# Altium schematic sheet Protoboard.SchDoc
size A
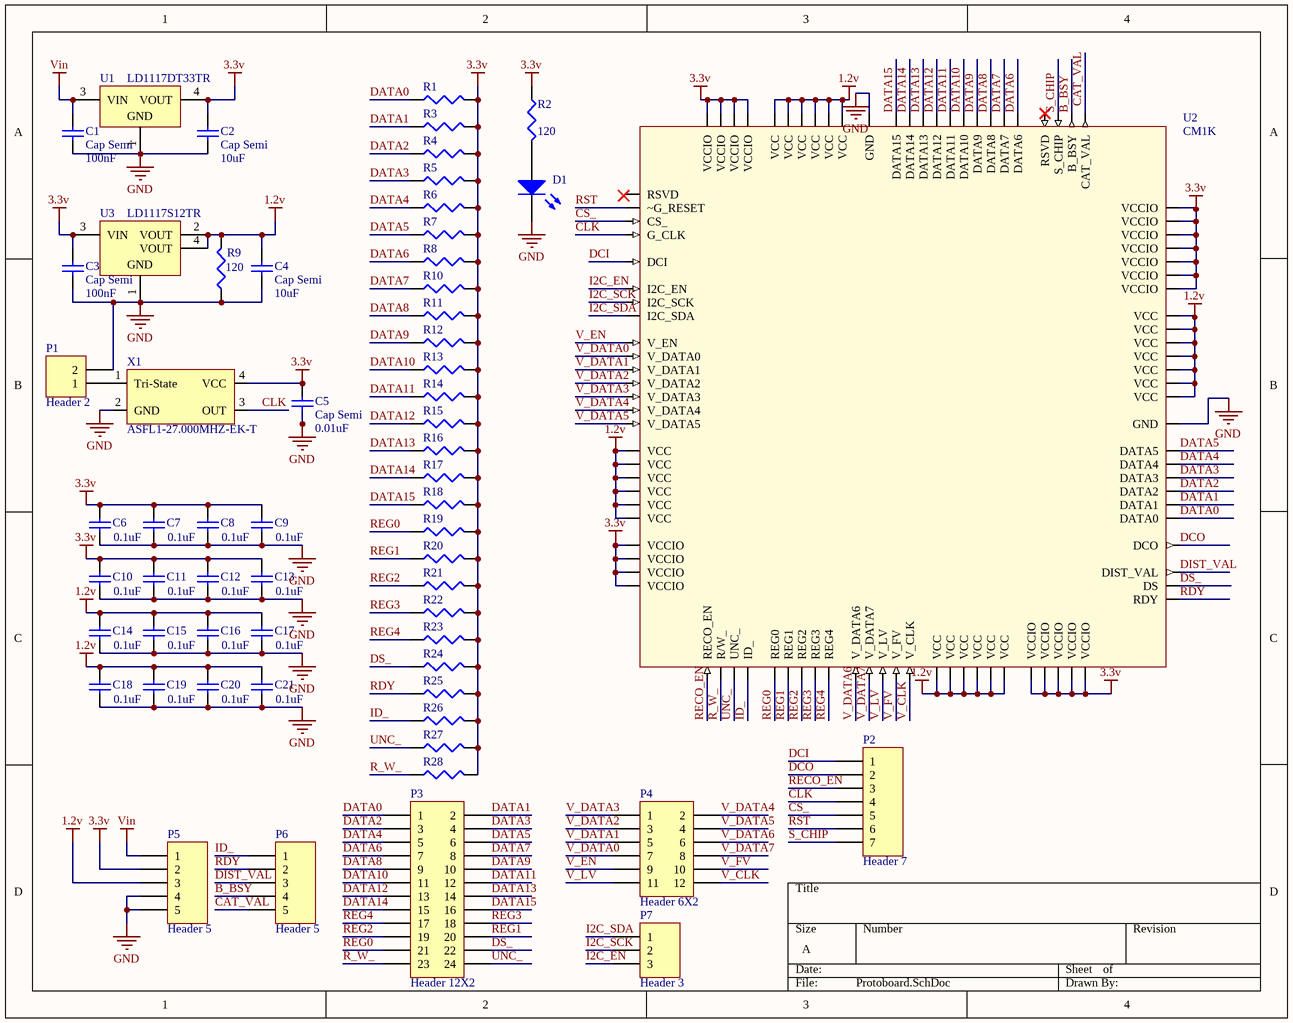
[diagram p0: Protoboard.SchDoc]

## Parts
C1  Cap Semi  value 100nF  [1608[0603]]
C2  Cap Semi  value 10uF  [1608[0603]]
C3  Cap Semi  value 100nF  [1608[0603]]
C4  Cap Semi  value 10uF  [1608[0603]]
C5  Cap Semi  value 0.01uF  [1608[0603]]
C6  value 0.1uF  [1608[0603]]  (hidden comment: Cap Semi)
C7  value 0.1uF  [1608[0603]]  (hidden comment: Cap Semi)
C8  value 0.1uF  [1608[0603]]  (hidden comment: Cap Semi)
C9  value 0.1uF  [1608[0603]]  (hidden comment: Cap Semi)
C10  value 0.1uF  [1608[0603]]  (hidden comment: Cap Semi)
C11  value 0.1uF  [1608[0603]]  (hidden comment: Cap Semi)
C12  value 0.1uF  [1608[0603]]  (hidden comment: Cap Semi)
C13  value 0.1uF  [1608[0603]]  (hidden comment: Cap Semi)
C14  value 0.1uF  [1608[0603]]  (hidden comment: Cap Semi)
C15  value 0.1uF  [1608[0603]]  (hidden comment: Cap Semi)
C16  value 0.1uF  [1608[0603]]  (hidden comment: Cap Semi)
C17  value 0.1uF  [1608[0603]]  (hidden comment: Cap Semi)
C18  value 0.1uF  [1608[0603]]  (hidden comment: Cap Semi)
C19  value 0.1uF  [1608[0603]]  (hidden comment: Cap Semi)
C20  value 0.1uF  [1608[0603]]  (hidden comment: Cap Semi)
C21  value 0.1uF  [1608[0603]]  (hidden comment: Cap Semi)
D1  150060BS75000  [0603_A]  (value not drawn)
P1  Header 2  [HDR1X2]
P2  Header 7  [HDR1X7]
P3  Header 12X2  [HDR2X12]
P4  Header 6X2  [HDR2X6]
P5  Header 5  [HDR1X5]
P6  Header 5  [HDR1X5]
P7  Header 3  [HDR1X3]
R1  Res3  [J1-0603]  (value not drawn)
R2  value 120  [J1-0603]  (hidden comment: Res3)
R3  Res3  [J1-0603]  (value not drawn)
R4  Res3  [J1-0603]  (value not drawn)
R5  Res3  [J1-0603]  (value not drawn)
R6  Res3  [J1-0603]  (value not drawn)
R7  Res3  [J1-0603]  (value not drawn)
R8  Res3  [J1-0603]  (value not drawn)
R9  value 120  [J1-0603]  (hidden comment: Res3)
R10  Res3  [J1-0603]  (value not drawn)
R11  Res3  [J1-0603]  (value not drawn)
R12  Res3  [J1-0603]  (value not drawn)
R13  Res3  [J1-0603]  (value not drawn)
R14  Res3  [J1-0603]  (value not drawn)
R15  Res3  [J1-0603]  (value not drawn)
R16  Res3  [J1-0603]  (value not drawn)
R17  Res3  [J1-0603]  (value not drawn)
R18  Res3  [J1-0603]  (value not drawn)
R19  Res3  [J1-0603]  (value not drawn)
R20  Res3  [J1-0603]  (value not drawn)
R21  Res3  [J1-0603]  (value not drawn)
R22  Res3  [J1-0603]  (value not drawn)
R23  Res3  [J1-0603]  (value not drawn)
R24  Res3  [J1-0603]  (value not drawn)
R25  Res3  [J1-0603]  (value not drawn)
R26  Res3  [J1-0603]  (value not drawn)
R27  Res3  [J1-0603]  (value not drawn)
R28  Res3  [J1-0603]  (value not drawn)
U1  LD1117DT33TR  [TO-252_N]
U2  CM1K  [TSQFP50P1600X1600X120-100N]
U3  LD1117S12TR  [SOT-223_M]
X1  ASFL1-27.000MHZ-EK-T  [Oscillator]

## Nets
1.2v: C4.2 C14.2 C15.2 C16.2 C17.2 C18.2 C19.2 C20.2 C21.2 P5.3 R9.2 U2.4(VCC) U2.11(VCC) U2.14(VCC) U2.17(VCC) U2.20(VCC) U2.22(VCC) U2.29(VCC) U2.31(VCC) U2.35(VCC) U2.38(VCC) U2.42(VCC) U2.45(VCC) U2.55(VCC) U2.56(VCC) U2.60(VCC) U2.61(VCC) U2.66(VCC) U2.70(VCC) U2.72(VCC) U2.83(VCC) U2.85(VCC) U2.89(VCC) U2.92(VCC) U2.94(VCC) U2.98(VCC) U3.2(VOUT) U3.4(VOUT)
3.3v: C2.2 C3.2 C5.2 C6.2 C7.2 C8.2 C9.2 C10.2 C11.2 C12.2 C13.2 P5.2 R1.2 R2.1 R3.2 R4.2 R5.2 R6.2 R7.2 R8.2 R10.2 R11.2 R12.2 R13.2 R14.2 R15.2 R16.2 R17.2 R18.2 R19.2 R20.2 R21.2 R22.2 R23.2 R24.2 R25.2 R26.2 R27.2 R28.2 U1.4(VOUT) U2.2(VCCIO) U2.7(VCCIO) U2.9(VCCIO) U2.12(VCCIO) U2.32(VCCIO) U2.34(VCCIO) U2.39(VCCIO) U2.44(VCCIO) U2.48(VCCIO) U2.51(VCCIO) U2.54(VCCIO) U2.59(VCCIO) U2.64(VCCIO) U2.68(VCCIO) U2.71(VCCIO) U2.74(VCCIO) U2.77(VCCIO) U2.79(VCCIO) U2.82(VCCIO) U2.86(VCCIO) U3.3(VIN) X1.4(VCC)
GND: C1.1 C2.1 C3.1 C4.1 C5.1 C6.1 C7.1 C8.1 C9.1 C10.1 C11.1 C12.1 C13.1 C14.1 C15.1 C16.1 C17.1 C18.1 C19.1 C20.1 C21.1 D1.1(K) P1.2 P5.4 P5.5 R9.1 U1.1(GND) U2.57(GND) U2.90(GND) U3.1(GND) X1.2(GND)
Vin: C1.2 P5.1 U1.3(VIN)
B_BSY: P6.4 U2.97(B_BSY)
CAT_VAL: P6.5 U2.96(CAT_VAL)
CLK: P2.4 U2.8(G_CLK) X1.3(OUT)
CS_: P2.5 U2.6(CS_)
DATA0: P3.1 R1.1 U2.63(DATA0)
DATA1: P3.2 R3.1 U2.65(DATA1)
DATA2: P3.3 R4.1 U2.67(DATA2)
DATA3: P3.4 R5.1 U2.69(DATA3)
DATA4: P3.5 R6.1 U2.73(DATA4)
DATA5: P3.6 R7.1 U2.75(DATA5)
DATA6: P3.7 R8.1 U2.76(DATA6)
DATA7: P3.8 R10.1 U2.78(DATA7)
DATA8: P3.9 R11.1 U2.80(DATA8)
DATA9: P3.10 R12.1 U2.81(DATA9)
DATA10: P3.11 R13.1 U2.84(DATA10)
DATA11: P3.12 R14.1 U2.87(DATA11)
DATA12: P3.13 R15.1 U2.88(DATA12)
DATA13: P3.14 R16.1 U2.91(DATA13)
DATA14: P3.15 R17.1 U2.93(DATA14)
DATA15: P3.16 R18.1 U2.95(DATA15)
DCI: P2.1 U2.13(DCI)
DCO: P2.2 U2.62(DCO)
DIST_VAL: P6.3 U2.58(DIST_VAL)
DS_: P3.22 R24.1 U2.53(DS)
I2C_EN: P7.3 U2.5(I2C_EN)
I2C_SCK: P7.2 U2.10(I2C_SCK)
I2C_SDA: P7.1 U2.15(I2C_SDA)
ID_: P6.1 R26.1 U2.50(ID_)
R_W_: P3.23 R28.1 U2.47(R/W_)
RDY: P6.2 R25.1 U2.52(RDY)
RECO_EN: P2.3 U2.46(RECO_EN)
REG0: P3.21 R19.1 U2.36(REG0)
REG1: P3.20 R20.1 U2.37(REG1)
REG2: P3.19 R21.1 U2.40(REG2)
REG3: P3.18 R22.1 U2.41(REG3)
REG4: P3.17 R23.1 U2.43(REG4)
RST: P2.6 U2.3(~G_RESET)
S_CHIP: P2.7 U2.99(S_CHIP)
UNC_: P3.24 R27.1 U2.49(UNC_)
V_CLK: P4.12 U2.33(V_CLK)
V_DATA0: P4.7 U2.18(V_DATA0)
V_DATA1: P4.5 U2.19(V_DATA1)
V_DATA2: P4.3 U2.21(V_DATA2)
V_DATA3: P4.1 U2.23(V_DATA3)
V_DATA4: P4.2 U2.24(V_DATA4)
V_DATA5: P4.4 U2.25(V_DATA5)
V_DATA6: P4.6 U2.26(V_DATA6)
V_DATA7: P4.8 U2.27(V_DATA7)
V_EN: P4.9 U2.16(V_EN)
V_FV: P4.10 U2.30(V_FV)
V_LV: P4.11 U2.28(V_LV)
NetD1_2: D1.2(A) R2.2
NetP1_1: P1.1 X1.1(Tri-State)

Not connected (* = marked no-connect by the designer): U2 1(RSVD) 100(RSVD)*

## Library data of the parts
C1-C21 = Cap Semi: Capacitor (Semiconductor SIM Model); Published: 8-Jun-2000; LatestRevisionDate: 29-May-2009; LatestRevisionNote: IPC-7351 Footprint Added.; PackageReference: C1206; Publisher: Altium Limited; PackageDescription: Chip Capacitor
D1 = CMP-1426-00003-1: SMD mono-color Chip LED, WL-SMCW, Blue; Manufacturer: Wuerth Elektronik; Color: Blue; ComponentLink2Description: Datasheet; ComponentLink2URL: http://katalog.we-online.com/led/datasheet/150060BS75000.pdf; ComponentLink1URL: http://www.we-online.com; PackageReference: 0603_A; PartNumber: 150060BS75000; ComponentLink1Description: Manufacturer URL
P1 = Header 2: Header, 2-Pin; LatestRevisionDate: 17-Jul-2002; LatestRevisionNote: Re-released for DXP Platform.; Publisher: Altium Limited
P2 = Header 7: Header, 7-Pin; LatestRevisionDate: 17-Jul-2002; LatestRevisionNote: Re-released for DXP Platform.; Publisher: Altium Limited
P3 = Header 12X2: Header, 12-Pin, Dual row; LatestRevisionDate: 17-Jul-2002; LatestRevisionNote: Re-released for DXP Platform.; Publisher: Altium Limited
P4 = Header 6X2: Header, 6-Pin, Dual row; LatestRevisionDate: 17-Jul-2002; LatestRevisionNote: Re-released for DXP Platform.; Publisher: Altium Limited
P5 P6 = Header 5: Header, 5-Pin; LatestRevisionDate: 17-Jul-2002; LatestRevisionNote: Re-released for DXP Platform.; Publisher: Altium Limited
P7 = Header 3: Header, 3-Pin; LatestRevisionDate: 17-Jul-2002; LatestRevisionNote: Re-released for DXP Platform.; Publisher: Altium Limited
R1 = Res3: Resistor; Value: 270; Published: 8-Jun-2000; LatestRevisionDate: 29-May-2009; LatestRevisionNote: IPC-7351 Footprint Added.; PackageReference: J1-0603; Publisher: Altium Limited; PackageDescription: Chip Resistor
R2 R9 = Res3: Resistor; Published: 8-Jun-2000; LatestRevisionDate: 29-May-2009; LatestRevisionNote: IPC-7351 Footprint Added.; PackageReference: J1-0603; Publisher: Altium Limited; PackageDescription: Chip Resistor
R3-R8 R10-R28 = Res3: Resistor; Value: 1K; Published: 8-Jun-2000; LatestRevisionDate: 29-May-2009; LatestRevisionNote: IPC-7351 Footprint Added.; PackageReference: J1-0603; Publisher: Altium Limited; PackageDescription: Chip Resistor
U1 = CMP-0244-00088-1: Fixed Low Drop Positive Voltage Regulator, 3.3V, 3-Pin DPAK, Tape and Reel; ComponentLink1Description: Manufacturer URL; PackageVersion: 2011; PackageReference: TO-252; ComponentLink2Description: Datasheet; ComponentLink1URL: http://www.st.com; DatasheetVersion: 1/11/2011; PackageDescription: 3-Pin Transistor Outline Package 2.28 mm Pitch, 9.7 mm Lead Span (DPAK); ComponentLink2URL: http://www.st.com/internet/com/TECHNICAL_RESOURCES/TECHNICAL_LITERATURE/DATASHEET/CD00000544.pdf
U3 = CMP-0244-00318-1: Fixed Low Drop Positive Voltage Regulator, 1.2V, 4-Pin SOT-223, Tape and Reel; PackageDescription: 4-Pin SOT-223 Package, 6.5 x 3.5 mm Body, 2.3 mm Pitch, 7 mm Lead Span; PackageVersion: 2010; ComponentLink2Description: Datasheet; PackageReference: SOT-223; ComponentLink2URL: http://www.st.com/internet/com/TECHNICAL_RESOURCES/TECHNICAL_LITERATURE/DATASHEET/CD00000544.pdf; ComponentLink1Description: Manufacturer URL; DatasheetVersion: 1/11/2011; ComponentLink1URL: http://www.st.com
X1 = Component_1